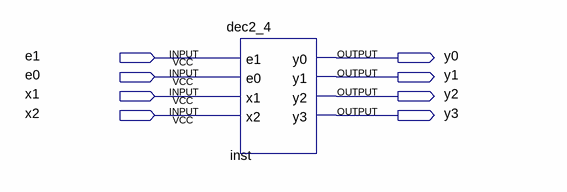
[diagram p0: schematic sheet]
// Quartus schematic decoderdemo2.bdf as structural Verilog: 1 symbols, 8 pins
module decoderdemo2 (
  input  e1,
  input  e0,
  input  x1,
  input  x2,
  output y0,
  output y1,
  output y2,
  output y3
);

  dec2_4 inst (.e1(e1), .e0(e0), .x1(x1), .x2(x2), .y0(y0), .y1(y1), .y2(y2), .y3(y3));
endmodule
